# EAGLE design humidor_controller_v20 (EAGLE 5.06)
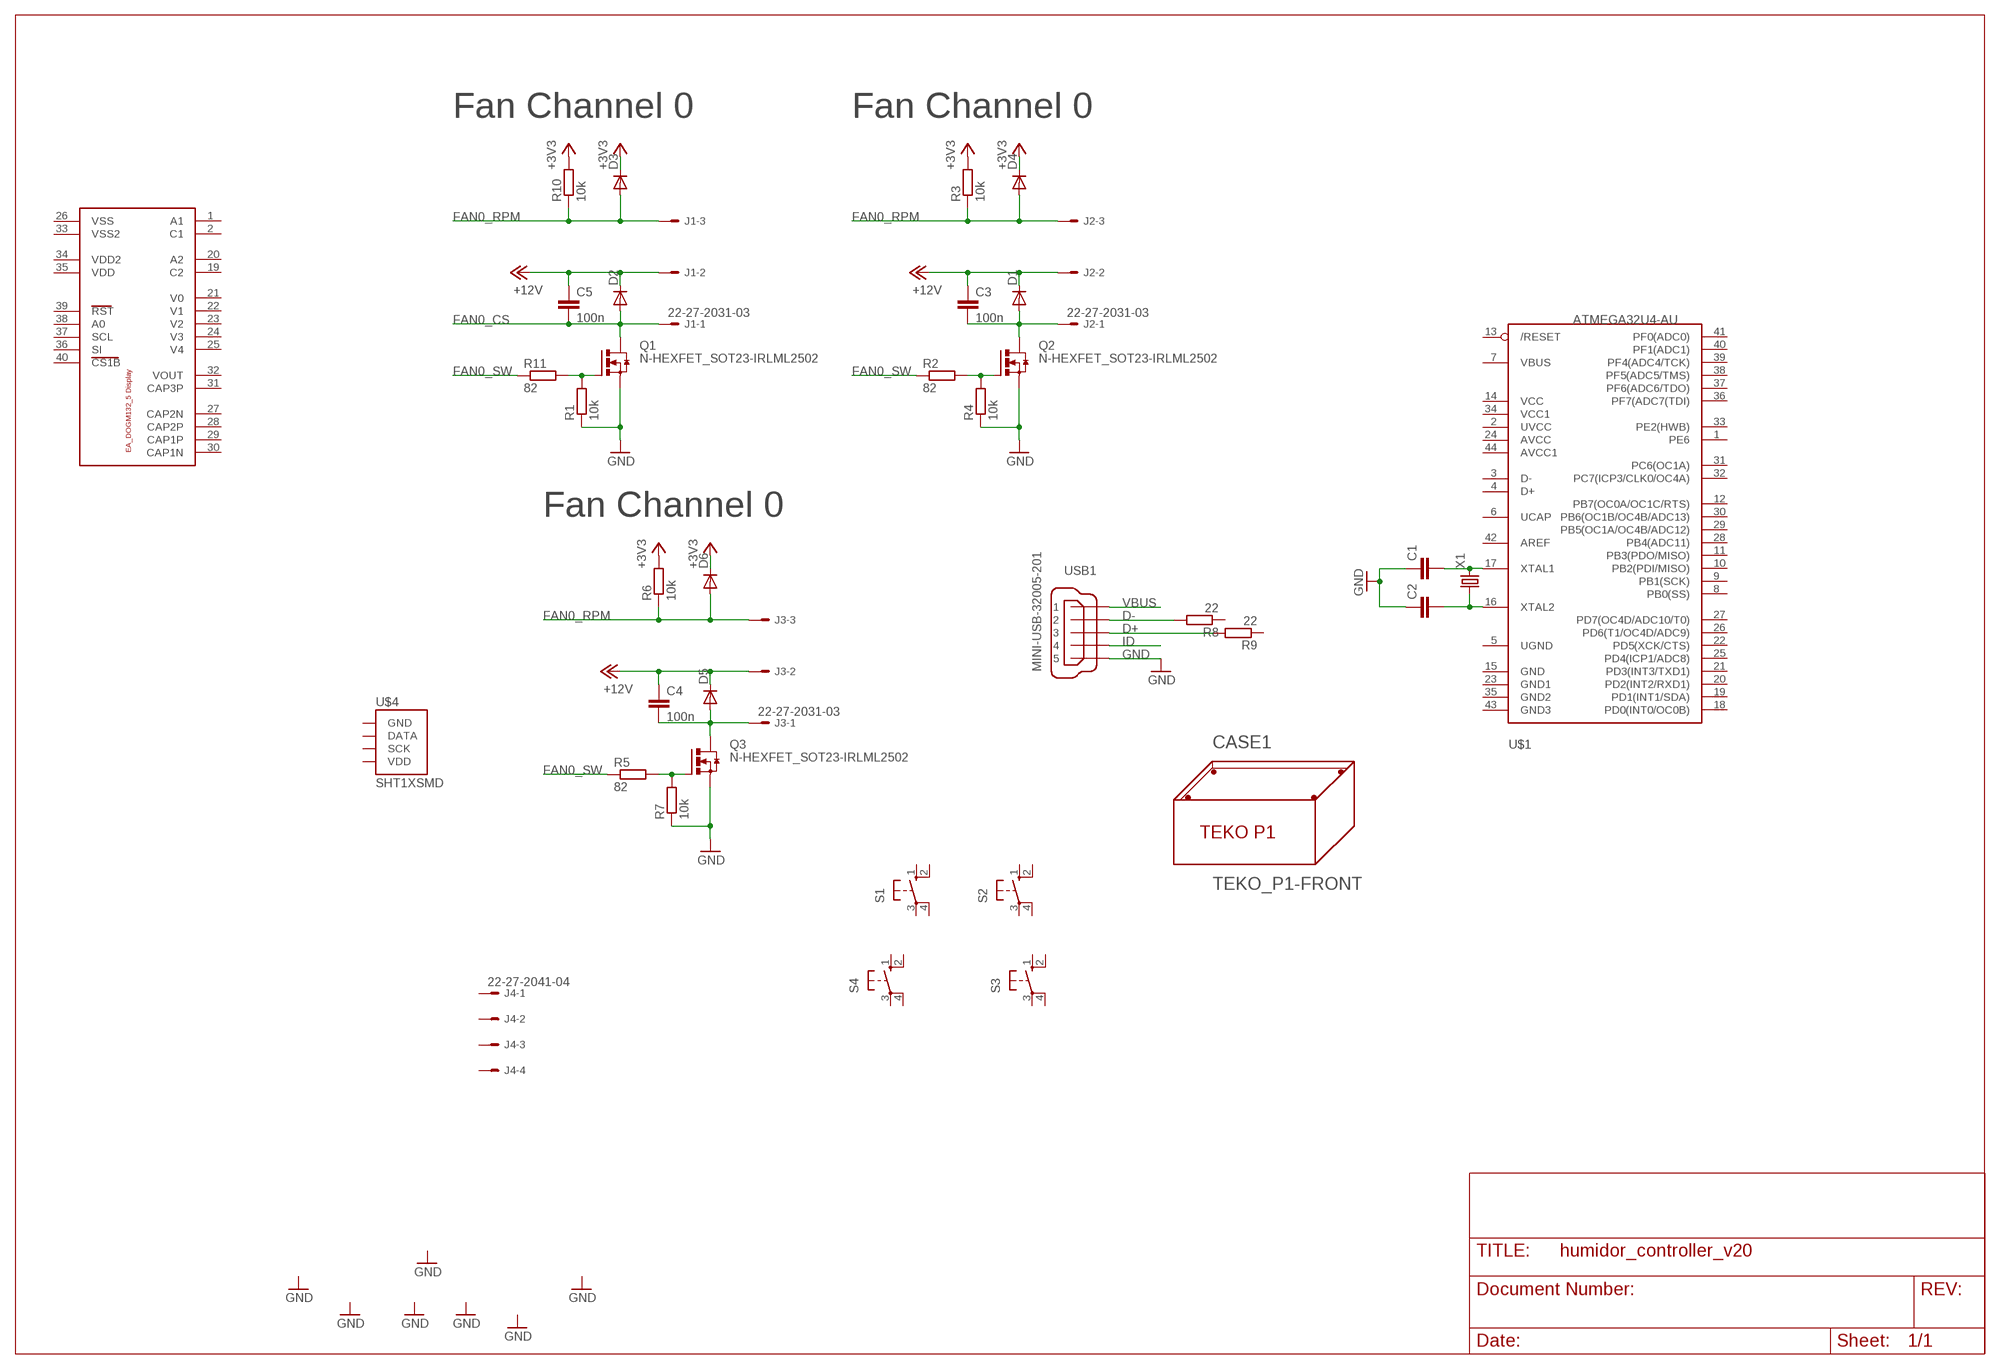
[diagram p0: schematic, sheet 1]

## Parts
C1  C-EUC0805  [C0805]
C2  C-EUC0805  [C0805]
C3  100n  C-EUC0805  [C0805]
C4  100n  C-EUC0805  [C0805]
C5  100n  C-EUC0805  [C0805]
CASE1  TEKO_P1-FRONT  [TEKO_P1_FRONT]
D1  DIODE-SOD323-R  [SOD323-R]
D2  DIODE-SOD323-R  [SOD323-R]
D3  DIODE-SOD323-R  [SOD323-R]
D4  DIODE-SOD323-R  [SOD323-R]
D5  DIODE-SOD323-R  [SOD323-R]
D6  DIODE-SOD323-R  [SOD323-R]
J1  22-27-2031-03  [6410-03]
J2  22-27-2031-03  [6410-03]
J3  22-27-2031-03  [6410-03]
J4  22-27-2041-04  [6410-04]
Q1  N-HEXFET_SOT23-IRLML2502  [SOT23]
Q2  N-HEXFET_SOT23-IRLML2502  [SOT23]
Q3  N-HEXFET_SOT23-IRLML2502  [SOT23]
R1  10k  R-EU_R0805  [R0805]
R2  82  R-EU_R0805  [R0805]
R3  10k  R-EU_R0805  [R0805]
R4  10k  R-EU_R0805  [R0805]
R5  82  R-EU_R0805  [R0805]
R6  10k  R-EU_R0805  [R0805]
R7  10k  R-EU_R0805  [R0805]
R8  22  R-EU_R0805  [R0805]
R9  22  R-EU_R0805  [R0805]
R10  10k  R-EU_R0805  [R0805]
R11  82  R-EU_R0805  [R0805]
S1  10-XX  [B3F-10XX]
S2  10-XX  [B3F-10XX]
S3  10-XX  [B3F-10XX]
S4  10-XX  [B3F-10XX]
U$1  ATMEGA32U4-AU  [TQFP44]
U$2  EA_DOG-M_DISPLAY  [E_DOG-M_DISPLAY]
U$4  SHT1XSMD  [SHT1X]
USB1  MINI-USB-32005-201  [32005-201]
X1  CRYSTAL5X3  [CRYSTAL-SMD-5X3]

## Nets
+3V3: D3.C D4.C D6.C R3.2 R6.2 R10.2
+12V: C3.1 C4.1 C5.1 D1.C D2.C D5.C J1.2 J2.2 J3.2
D+: R9.2 USB1.3
D-: R8.2 USB1.2
FAN0_CS: C5.2 D2.A J1.1 Q1.3(D)
FAN0_RPM: D3.A D4.A D6.A J1.3 J2.3 J3.3 R3.1 R6.1 R10.1
FAN0_SW: R2.1 R5.1 R11.1
GND: C1.1 C2.1 Q1.2(S) Q2.2(S) Q3.2(S) R1.1 R4.1 R7.1 USB1.5
ID: USB1.4
N$2: C2.2 U$1.16(XTAL2) X1.1
N$3: C1.2 U$1.17(XTAL1) X1.3
N$4: Q2.1(G) R2.2 R4.2
N$5: C3.2 D1.A J2.1 Q2.3(D)
N$6: Q3.1(G) R5.2 R7.2
N$7: C4.2 D5.A J3.1 Q3.3(D)
N$9: Q1.1(G) R1.2 R11.2
VBUS: USB1.1
Unconnected: J4.1 J4.2 J4.3 J4.4 R8.1 R9.1 S1.1(S) S1.2(S1) S1.3(P) S1.4(P1) S2.1(S) S2.2(S1) S2.3(P) S2.4(P1) S3.1(S) S3.2(S1) S3.3(P) S3.4(P1) S4.1(S) S4.2(S1) S4.3(P) S4.4(P1) U$1.1(PE6) U$1.2(UVCC) U$1.3(D-) U$1.4(D+) U$1.5(UGND) U$1.6(UCAP) U$1.7(VBUS) U$1.8(PB0(SS)) U$1.9(PB1(SCK)) U$1.10(PB2(PDI/MISO)) U$1.11(PB3(PDO/MISO)) U$1.12(PB7(OC0A/OC1C/RTS)) U$1.13(/RESET) U$1.14(VCC) U$1.15(GND) U$1.18(PD0(INT0/OC0B)) U$1.19(PD1(INT1/SDA)) U$1.20(PD2(INT2/RXD1)) U$1.21(PD3(INT3/TXD1)) U$1.22(PD5(XCK/CTS)) U$1.23(GND1) U$1.24(AVCC) U$1.25(PD4(ICP1/ADC8)) U$1.26(PD6(T1/OC4D/ADC9)) U$1.27(PD7(OC4D/ADC10/T0)) U$1.28(PB4(ADC11)) U$1.29(PB5(OC1A/OC4B/ADC12)) U$1.30(PB6(OC1B/OC4B/ADC13)) U$1.31(PC6(OC1A)) U$1.32(PC7(ICP3/CLK0/OC4A)) U$1.33(PE2(HWB)) U$1.34(VCC1) U$1.35(GND2) U$1.36(PF7(ADC7(TDI)) U$1.37(PF6(ADC6/TDO)) U$1.38(PF5(ADC5/TMS)) U$1.39(PF4(ADC4/TCK)) U$1.40(PF1(ADC1)) U$1.41(PF0(ADC0)) U$1.42(AREF) U$1.43(GND3) U$1.44(AVCC1) U$2.1(A1) U$2.2(C1) U$2.19(C2) U$2.20(A2) U$2.23(V2) U$2.24(V3) U$2.25(V4) U$2.26(VSS) U$2.27(CAP2N) U$2.28(CAP2P) U$2.29(CAP1P) U$2.30(CAP1N) U$2.31(CAP3P) U$2.32(VOUT) U$2.33(VSS2) U$2.34(VDD2) U$2.35(VDD) U$2.36(SI) U$2.37(SCL) U$2.38(A0) U$2.39(RST) U$2.40(CS1B) U$4.2(DATA) U$4.3(SCK)

## Notes on the sheet
- Fan Channel 0 | Fan Channel 0
- Fan Channel 0

## Power pins joined to a net without a drawn wire
GND: U$4.1(GND)
V0: U$2.21(V0)
V1: U$2.22(V1)
VDD: U$4.4(VDD)

## Library data of the parts
C1 C2 = rcl:C-EU: CAPACITOR, European symbol
C3-C5 = resistor:C-EU: CAPACITOR, European symbol
CASE1 = ferdinandkeil:TEKO_P1-: TEKO P1 Case - Serie Optative 85 x 56 x 35 mm
D1-D6 = diode:DIODE-: DIODE
J1-J3 = con-molex:22-?-03: CONNECTOR wire to board 2.54 mm (.1 inch) pitch header
J4 = con-molex:22-?-04: CONNECTOR wire to board 2.54 mm (.1 inch) pitch header
Q1-Q3 = ferdinandkeil:N-HEXFET_?-*: HEXFET® Power MOSFET
R1-R11 = resistor:R-EU_: RESISTOR, European symbol
S1-S4 = switch-omron:10-XX: OMRON SWITCH
U$1 = adafruit:ATMEGA32U4: http://www.ladyada.net/library/eagle
U$2 = display_ea_dogm132:EA_DOG-M_DISPLAY
U$4 = SparkFun:SHT1X: SHT1x Humdity Sensor Sensirion humdity sensor. Schematic element and footprint proven. Spark Fun Electronics SKU : COM-08227
USB1 = con-cypressindustries:MINI-USB-: MINI USB-B Conector Source: www.cypressindustries.com
X1 = SparkFun:CRYSTAL: Crystals Various standard crystals. Proven footprints. Spark Fun Electronics SKU : COM-00534

## Board
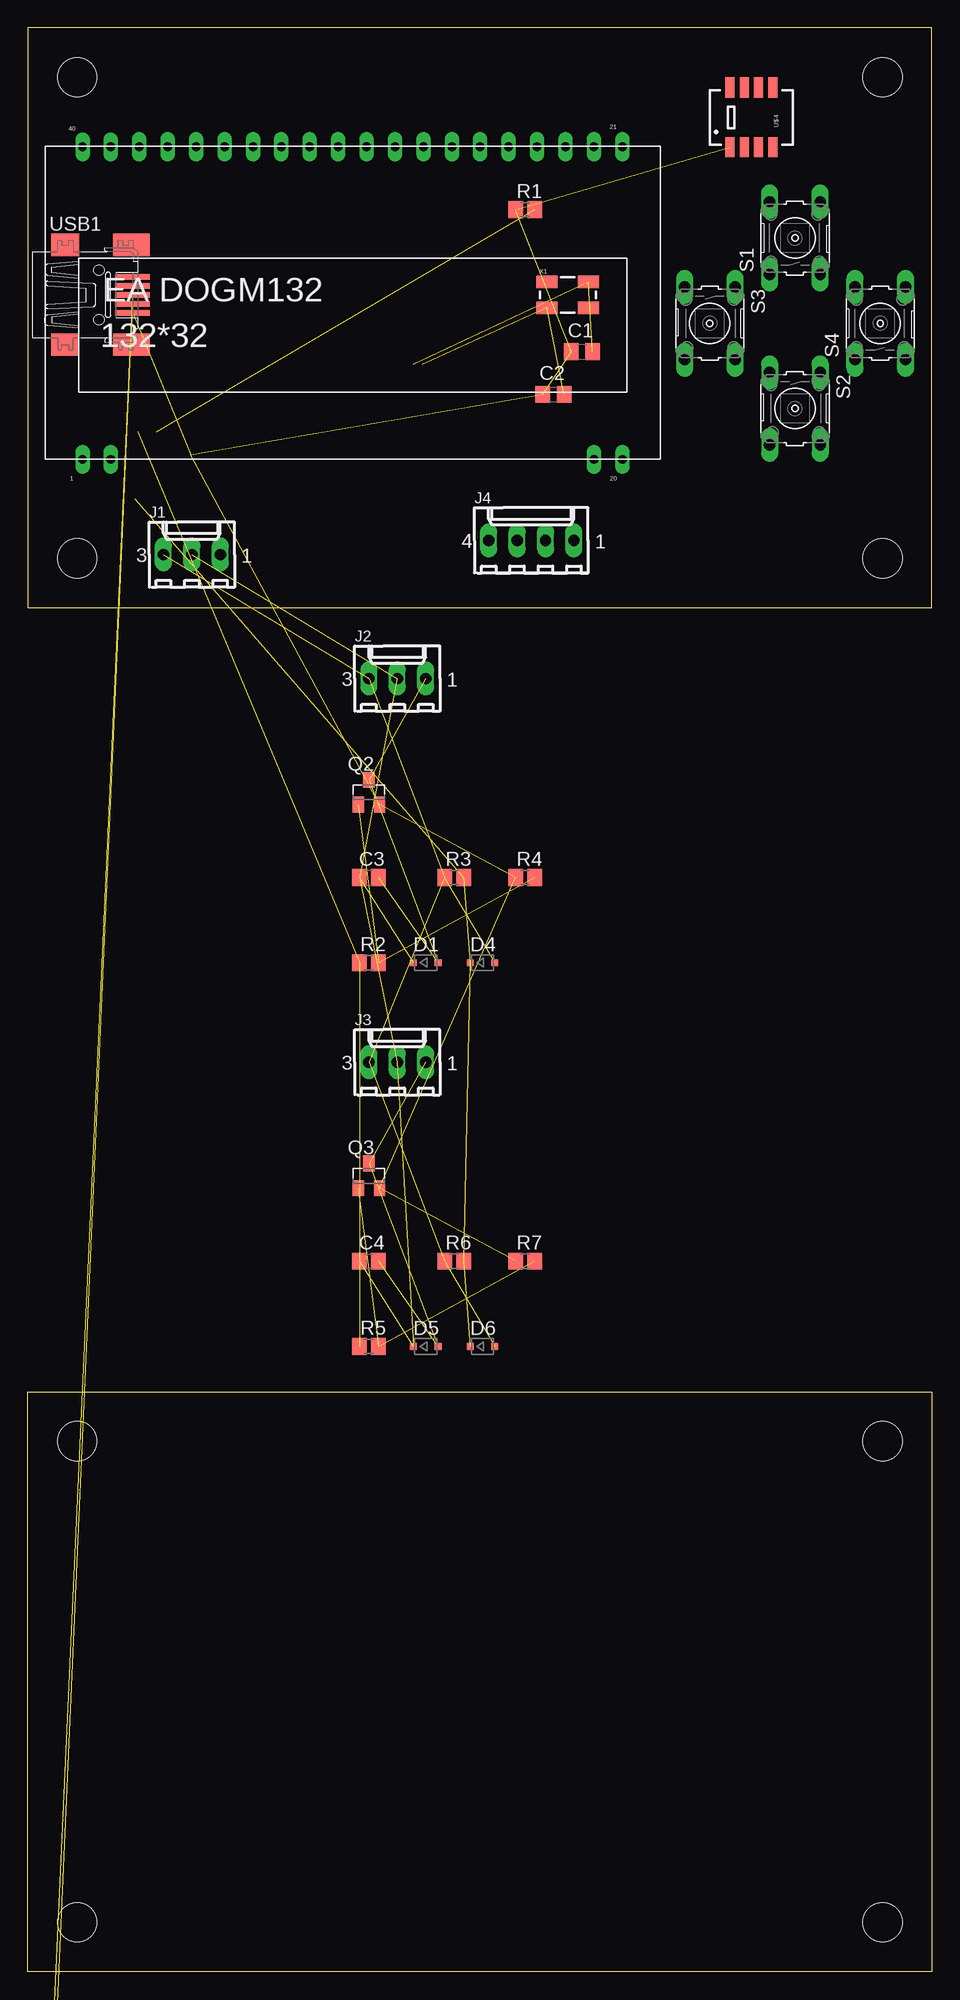
[diagram p1: board, top side]
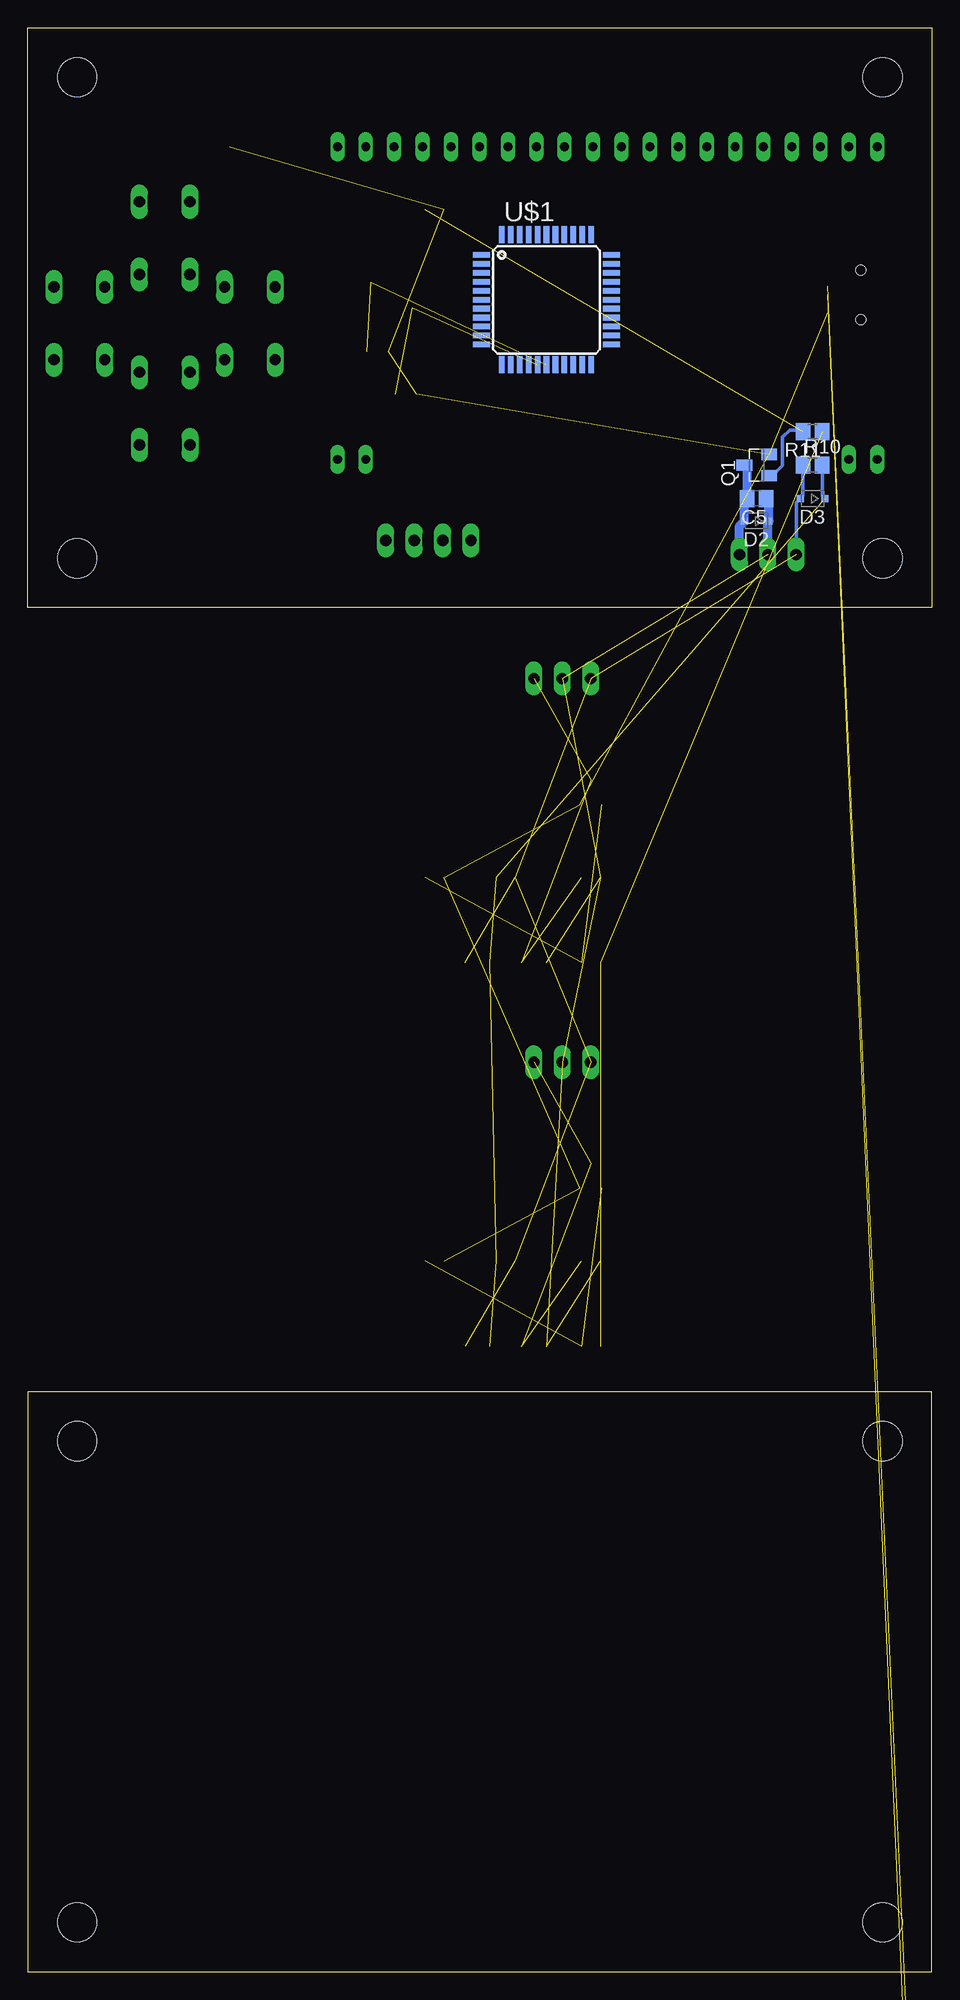
[diagram p2: board, bottom side, seen from below]

Size 80.8 x 51.8 mm. Coordinates in mm from the lower left corner, seen from the top.
Outline: 0,0 80.8,0 80.8,51.8 0,51.8 0,0
Copper layers (1*16): Top 0.035mm / dielectric 1.5mm / Bottom 0.035mm
Design rules "default": minimum track width 10mil, minimum drill 24mil, track to track 8mil, track to pad 8mil, pad to pad 8mil, via to via 8mil, smd to smd 8mil, copper to edge 40mil, drill to drill 8mil, minimum pad ring 10mil, minimum via ring 8mil, stop-mask expansion 4mil, vias tented up to drill 0mil, thermal gap 10mil
Holes 3.5 mm at 4.4,4.4 76.4,4.4 4.4,47.4 76.4,47.4

### Footprints (pad centres in the part's own frame; a part is rotated, then mirrored left to right if it is on the bottom)
C0805 = smd 1.3 x 1.5: 1 -0.95,0; 2 0.95,0
C0805' = smd 1.3 x 1.5: 1 -0.85,0; 2 0.85,0
TEKO_P1_FRONT = hole 3.5: 4.4,4.4; 4.4,47.4; 76.4,4.4; 76.4,47.4
SOD323-R = smd 0.6 x 0.6: A 1.1,0; C -1.1,0
6410-03 = drill 1.016 long: 1 2.54,0; 2 0,0; 3 -2.54,0
6410-04 = drill 1.016 long: 1 3.81,0; 2 1.27,0; 3 -1.27,0; 4 -3.81,0
SOT23 = smd 1 x 1.4: 1 -0.95,-1.1; 2 0.95,-1.1; 3 0,1.1
R0805 = smd 1.3 x 1.5: 1 -0.85,0; 2 0.85,0
B3F-10XX = drill 1.016 long: 1 -3.251,2.261; 2 3.251,2.261; 3 -3.251,-2.261; 4 3.251,-2.261
TQFP44 = smd 1.5 x 0.5: 1 -5.8,4; 2 -5.8,3.2; 3 -5.8,2.4; 4 -5.8,1.6; 5 -5.8,0.8; 6 -5.8,0; 7 -5.8,-0.8; 8 -5.8,-1.6; 9 -5.8,-2.4; 10 -5.8,-3.2; 11 -5.8,-4; 23 5.8,-4; 24 5.8,-3.2; 25 5.8,-2.4; 26 5.8,-1.6; 27 5.8,-0.8; 28 5.8,0; 29 5.8,0.8; 30 5.8,1.6; 31 5.8,2.4; 32 5.8,3.2; 33 5.8,4 | smd 0.5 x 1.5: 12 -4,-5.8; 13 -3.2,-5.8; 14 -2.4,-5.8; 15 -1.6,-5.8; 16 -0.8,-5.8; 17 0,-5.8; 18 0.8,-5.8; 19 1.6,-5.8; 20 2.4,-5.8; 21 3.2,-5.8; 22 4,-5.8; 34 4,5.8; 35 3.2,5.8; 36 2.4,5.8; 37 1.6,5.8; 38 0.8,5.8; 39 0,5.8; 40 -0.8,5.8; 41 -1.6,5.8; 42 -2.4,5.8; 43 -3.2,5.8; 44 -4,5.8
E_DOG-M_DISPLAY = drill 0.8 long: 1 3.334,0; 2 5.874,0; 19 49.054,0; 20 51.594,0; 21 51.594,27.94; 22 49.054,27.94; 23 46.514,27.94; 24 43.974,27.94; 25 41.434,27.94; 26 38.894,27.94; 27 36.354,27.94; 28 33.814,27.94; 29 31.274,27.94; 30 28.734,27.94; 31 26.194,27.94; 32 23.654,27.94; 33 21.114,27.94; 34 18.574,27.94; 35 16.034,27.94; 36 13.494,27.94; 37 10.954,27.94; 38 8.414,27.94; 39 5.874,27.94; 40 3.334,27.94
SHT1X = smd 1.8 x 0.8: 1 -2.667,1.905; 2 -2.667,0.635; 3 -2.667,-0.635; 4 -2.667,-1.905; 5 2.667,-1.905; 6 2.667,-0.635; 7 2.667,0.635; 8 2.667,1.905
32005-201 = smd 3.1 x 0.5: 1 3,1.6; 2 3,0.8; 3 3,0; 4 3,-0.8; 5 3,-1.6 | smd 2.5 x 2: M1 -3,-4.45; M2 -3,4.45 | smd 3.3 x 2: M3 2.9,4.45; M4 2.9,-4.45 | hole 0.9: 0,2.2; 0,-2.2
CRYSTAL-SMD-5X3 = smd 1.9 x 1.1: 1 -1.85,-1.15; 2 1.85,-1.15; 3 1.85,1.15; 4 -1.85,1.15

### Placement (x,y rotation side)
C1  49.53,22.86 0 top
C2  46.99,19.05 0 top
C3  100n  [C0805']  30.48,-24.13 0 top  (outside the outline)
C4  100n  [C0805']  30.48,-58.42 0 top  (outside the outline)
C5  100n  [C0805']  15.65,9.73 180 bottom
CASE1  0,-121.92 0 top  (outside the outline)
D1  35.56,-31.75 0 top  (outside the outline)
D2  15.65,7.73 180 bottom
D3  10.65,9.73 180 bottom
D4  40.64,-31.75 0 top  (outside the outline)
D5  35.56,-66.04 0 top  (outside the outline)
D6  40.64,-66.04 0 top  (outside the outline)
J1  14.65,4.73 0 top
J2  33.02,-6.35 0 top  (outside the outline)
J3  33.02,-40.64 0 top  (outside the outline)
J4  45,6 0 top
Q1  15.65,12.73 90 bottom
Q2  30.48,-16.51 0 top  (outside the outline)
Q3  30.48,-50.8 0 top  (outside the outline)
R1  44.45,35.56 0 top
R2  30.48,-31.75 0 top  (outside the outline)
R3  38.1,-24.13 0 top  (outside the outline)
R4  44.45,-24.13 0 top  (outside the outline)
R5  30.48,-66.04 0 top  (outside the outline)
R6  38.1,-58.42 0 top  (outside the outline)
R7  44.45,-58.42 0 top  (outside the outline)
R8  1.27,-129.54 0 top  (outside the outline)
R9  1.27,-135.89 0 top  (outside the outline)
R10  10.65,12.73 0 bottom
R11  10.65,15.73 180 bottom
S1  68.58,33.02 90 top
S2  68.58,17.78 270 top
S3  60.96,25.4 270 top
S4  76.2,25.4 90 top
U$1  34.44,27.51 0 bottom
U$2  1.54,13.24 0 top
U$4  64.68,43.81 90 top
USB1  6.35,27.94 0 top
X1  48.26,27.94 0 top

### Tracks (layer width: path | path; a pad name or v marks a point on that pad's centre or on a via)
+3V3  (4 unrouted)
  Bottom 0.305: R10.2 9.8,9.98 D3.C
+12V  (6 unrouted)
  Bottom 0.813: J1.2 14.65,7.63 D2.C 14.55,9.48 C5.1
D+  (1 unrouted)
D-  (1 unrouted)
FAN0_CS
  Bottom 0.813: J1.1 17.19,7.29 D2.A 16.75,9.48 C5.2 16.5,12.48 Q1.3
FAN0_RPM  (6 unrouted)
  Bottom 0.305: J1.3 12.11,9.37 D3.A 11.5,9.98 R10.1
FAN0_SW  (2 unrouted)
GND  (9 unrouted)
N$2  (2 unrouted)
N$3  (2 unrouted)
N$4  (2 unrouted)
N$5  (3 unrouted)
N$6  (2 unrouted)
N$7  (3 unrouted)
N$9  (1 unrouted)
  Bottom 0.305: Q1.1 14.26,11.78 13.34,12.7 13.34,15.24 12.7,15.88 11.64,15.88 R11.2

### Text on the board
Document: Maße Aluminium Frontplatte | Maße Gehäuse Innen (ohne Leiterplatten Führungen)